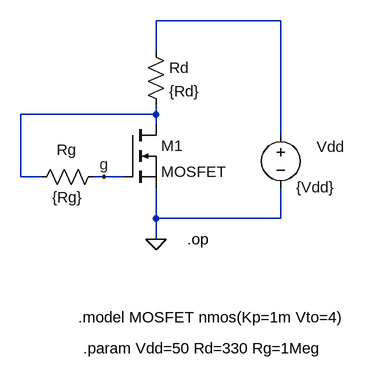
[diagram p0: schematic FET08op.asc]
FET08op.asc, the LTspice schematic file:
Version 4
SHEET 1 1608 1076
WIRE 384 -128 192 -128
WIRE 192 -80 192 -128
WIRE 192 16 192 0
WIRE 192 16 -16 16
WIRE 192 32 192 16
WIRE 384 48 384 -128
WIRE -16 112 -16 16
WIRE 16 112 -16 112
WIRE 112 112 96 112
WIRE 144 112 112 112
WIRE 192 176 192 128
WIRE 384 176 384 128
WIRE 384 176 192 176
WIRE 192 208 192 176
FLAG 192 208 0
FLAG 112 112 g
SYMBOL res 112 96 R90
WINDOW 0 -10 57 VBottom 2
WINDOW 3 32 56 VTop 2
SYMATTR InstName Rg
SYMATTR Value {Rg}
SYMBOL voltage 384 32 R0
WINDOW 0 55 34 Left 2
WINDOW 123 0 0 Left 0
WINDOW 39 0 0 Left 0
SYMATTR InstName Vdd
SYMATTR Value {Vdd}
SYMBOL res 176 -96 R0
SYMATTR InstName Rd
SYMATTR Value {Rd}
SYMBOL nmos 144 32 R0
SYMATTR InstName M1
SYMATTR Value MOSFET
TEXT 240 208 Left 2 !.op
TEXT 72 328 Left 2 !.model MOSFET nmos(Kp=1m Vto=4)
TEXT 80 376 Left 2 !.param Vdd=50 Rd=330 Rg=1Meg

The netlist it stands for:
* FET08op.asc
Rg g N002 {Rg}
Vdd N001 0 {Vdd}
Rd N001 N002 {Rd}
M1 N002 g 0 0 MOSFET
.model NMOS NMOS
.model PMOS PMOS
.lib standard.mos
.op
.model MOSFET nmos(Kp=1m Vto=4)
.param Vdd=50 Rd=330 Rg=1Meg
.backanno
.end